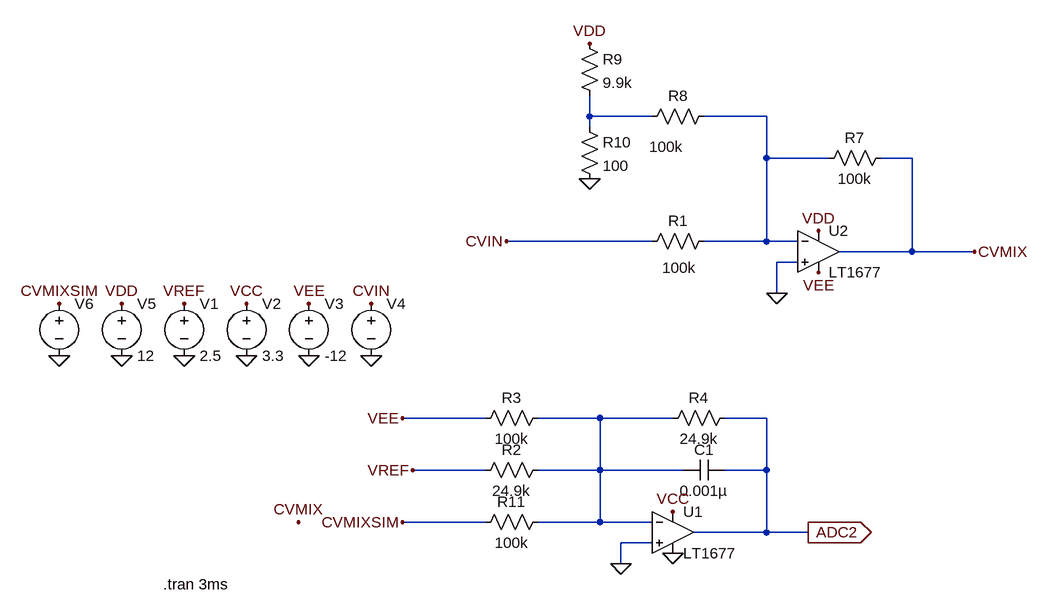
[diagram p0: schematic CV-in-with-pot.asc]
CV-in-with-pot.asc, the LTspice schematic file:
Version 4
SHEET 1 1568 680
WIRE 640 -272 640 -304
WIRE 736 -272 640 -272
WIRE 912 -272 816 -272
WIRE 640 -256 640 -272
WIRE 912 -208 912 -272
WIRE 1008 -208 912 -208
WIRE 1136 -208 1088 -208
WIRE 736 -80 512 -80
WIRE 912 -80 912 -208
WIRE 912 -80 816 -80
WIRE 960 -80 912 -80
WIRE 1136 -64 1136 -208
WIRE 1136 -64 1024 -64
WIRE 1232 -64 1136 -64
WIRE 960 -48 928 -48
WIRE 928 0 928 -48
WIRE 480 192 352 192
WIRE 656 192 560 192
WIRE 768 192 656 192
WIRE 912 192 848 192
WIRE 480 272 368 272
WIRE 656 272 656 192
WIRE 656 272 560 272
WIRE 784 272 656 272
WIRE 912 272 912 192
WIRE 912 272 848 272
WIRE 480 352 352 352
WIRE 656 352 656 272
WIRE 656 352 560 352
WIRE 736 352 656 352
WIRE 912 368 912 272
WIRE 912 368 800 368
WIRE 976 368 912 368
WIRE 736 384 688 384
WIRE 688 416 688 384
FLAG 16 96 0
FLAG 112 96 0
FLAG 208 96 0
FLAG 16 16 VREF
FLAG 112 16 VCC
FLAG 208 16 VEE
FLAG 304 96 0
FLAG 304 16 CVIN
FLAG 768 400 0
FLAG 768 336 VCC
FLAG 688 416 0
FLAG 976 368 ADC2
IOPIN 976 368 Out
FLAG -80 16 VDD
FLAG -80 96 0
FLAG 512 -80 CVIN
FLAG 640 -176 0
FLAG 1232 -64 CVMIX
FLAG 192 352 CVMIX
FLAG 992 -96 VDD
FLAG 928 0 0
FLAG 992 -32 VEE
FLAG 368 272 VREF
FLAG 352 192 VEE
FLAG 640 -384 VDD
FLAG -176 96 0
FLAG -176 16 CVMIXSIM
FLAG 352 352 CVMIXSIM
SYMBOL voltage 16 0 R0
WINDOW 123 0 0 Left 2
WINDOW 39 0 0 Left 2
SYMATTR InstName V1
SYMATTR Value 2.5
SYMBOL voltage 112 0 R0
WINDOW 123 0 0 Left 2
WINDOW 39 0 0 Left 2
SYMATTR InstName V2
SYMATTR Value 3.3
SYMBOL voltage 208 0 R0
WINDOW 123 0 0 Left 2
WINDOW 39 0 0 Left 2
SYMATTR InstName V3
SYMATTR Value -12
SYMBOL voltage 304 0 R0
WINDOW 3 24 96 Invisible 2
WINDOW 123 0 0 Left 2
WINDOW 39 0 0 Left 2
SYMATTR Value SINE(6 5 1000)
SYMATTR InstName V4
SYMBOL res 832 -96 R90
WINDOW 0 0 56 VBottom 2
WINDOW 3 41 54 VTop 2
SYMATTR InstName R1
SYMATTR Value 100k
SYMATTR SpiceLine tol=1 pwr=1
SYMBOL res 576 256 R90
WINDOW 0 0 56 VBottom 2
WINDOW 3 32 56 VTop 2
SYMATTR InstName R2
SYMATTR Value 24.9k
SYMATTR SpiceLine tol=1 pwr=1
SYMBOL res 576 176 R90
WINDOW 0 0 56 VBottom 2
WINDOW 3 32 56 VTop 2
SYMATTR InstName R3
SYMATTR Value 100k
SYMATTR SpiceLine tol=1 pwr=1
SYMBOL res 864 176 R90
WINDOW 0 0 56 VBottom 2
WINDOW 3 32 56 VTop 2
SYMATTR InstName R4
SYMATTR Value 24.9k
SYMATTR SpiceLine tol=1 pwr=1
SYMBOL cap 848 256 R90
WINDOW 0 0 32 VBottom 2
WINDOW 3 32 32 VTop 2
SYMATTR InstName C1
SYMATTR Value 0.001µ
SYMATTR SpiceLine V=25 Irms=63.1m Rser=3.62516 Lser=0 mfg="KEMET" pn="C0402C102K3RAC" type="X7R"
SYMBOL Opamps\\LT1677 768 304 R0
SYMATTR InstName U1
SYMBOL voltage -80 0 R0
WINDOW 123 0 0 Left 2
WINDOW 39 0 0 Left 2
SYMATTR InstName V5
SYMATTR Value 12
SYMBOL res 1104 -224 R90
WINDOW 0 0 56 VBottom 2
WINDOW 3 32 56 VTop 2
SYMATTR InstName R7
SYMATTR Value 100k
SYMATTR SpiceLine tol=1 pwr=1
SYMBOL res 832 -288 R90
WINDOW 0 0 56 VBottom 2
WINDOW 3 47 74 VTop 2
SYMATTR InstName R8
SYMATTR Value 100k
SYMATTR SpiceLine tol=1 pwr=1
SYMBOL res 624 -400 R0
SYMATTR InstName R9
SYMATTR Value 9.9k
SYMATTR SpiceLine tol=1 pwr=1
SYMBOL res 624 -272 R0
SYMATTR InstName R10
SYMATTR Value 100
SYMBOL Opamps\\LT1677 992 -128 R0
SYMATTR InstName U2
SYMBOL res 576 336 R90
WINDOW 0 0 56 VBottom 2
WINDOW 3 32 56 VTop 2
SYMATTR InstName R11
SYMATTR Value 100k
SYMATTR SpiceLine tol=1 pwr=1
SYMBOL voltage -176 0 R0
WINDOW 3 24 96 Invisible 2
WINDOW 123 0 0 Left 2
WINDOW 39 0 0 Left 2
SYMATTR Value SINE(-6 -5 1000)
SYMATTR InstName V6
TEXT -16 448 Left 2 !.tran 3ms

The netlist it stands for:
* CV-in-with-pot.asc
V1 VREF 0 2.5
V2 VCC 0 3.3
V3 VEE 0 -12
V4 CVIN 0 SINE(6 5 1000)
R1 N002 CVIN 100k tol=1 pwr=1
R2 N003 VREF 24.9k tol=1 pwr=1
R3 N003 VEE 100k tol=1 pwr=1
R4 ADC2 N003 24.9k tol=1 pwr=1
C1 ADC2 N003 0.001µ V=25 Irms=63.1m Rser=3.62516 Lser=0 mfg="KEMET" pn="C0402C102K3RAC" type="X7R"
XU1 0 N003 VCC 0 ADC2 LT1677  ; pins In+ In- V+ V- OUT
V5 VDD 0 12
R7 CVMIX N002 100k tol=1 pwr=1
R8 N002 N001 100k tol=1 pwr=1
R9 VDD N001 9.9k tol=1 pwr=1
R10 N001 0 100
XU2 0 N002 VDD VEE CVMIX LT1677  ; pins In+ In- V+ V- OUT
R11 N003 CVMIXSIM 100k tol=1 pwr=1
V6 CVMIXSIM 0 SINE(-6 -5 1000)
.tran 3ms
.lib LTC.lib
.backanno
.end

* Results of the author's LTspice run, read from the files saved beside the schematic
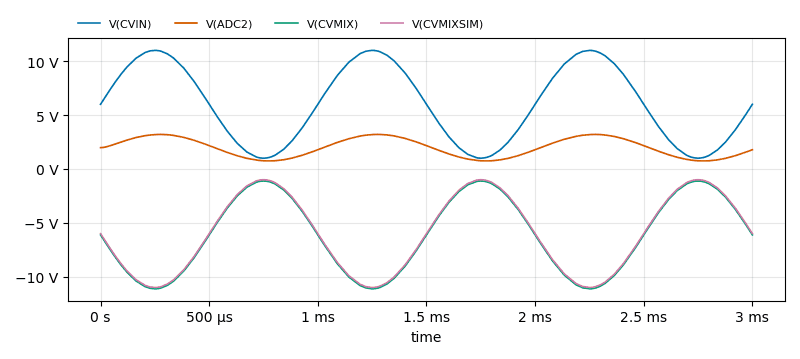
[diagram p1: Transient Analysis of CV-in-with-pot.asc, plotted from the saved traces]
* Transient Analysis, 1 run:
*   V(CVIN): min 1 V, max 11 V, average 5.999 V, rms 6.969 V, last 6 V
*   V(ADC2): min 742.4 mV, max 3.202 V, average 1.973 V, rms 2.158 V, last 1.782 V
*   V(CVMIX): min -11.12 V, max -1.12 V, average -6.118 V, rms 7.072 V, last -6.118 V
*   V(CVMIXSIM): min -11 V, max -1 V, average -5.999 V, rms 6.969 V, last -6 V